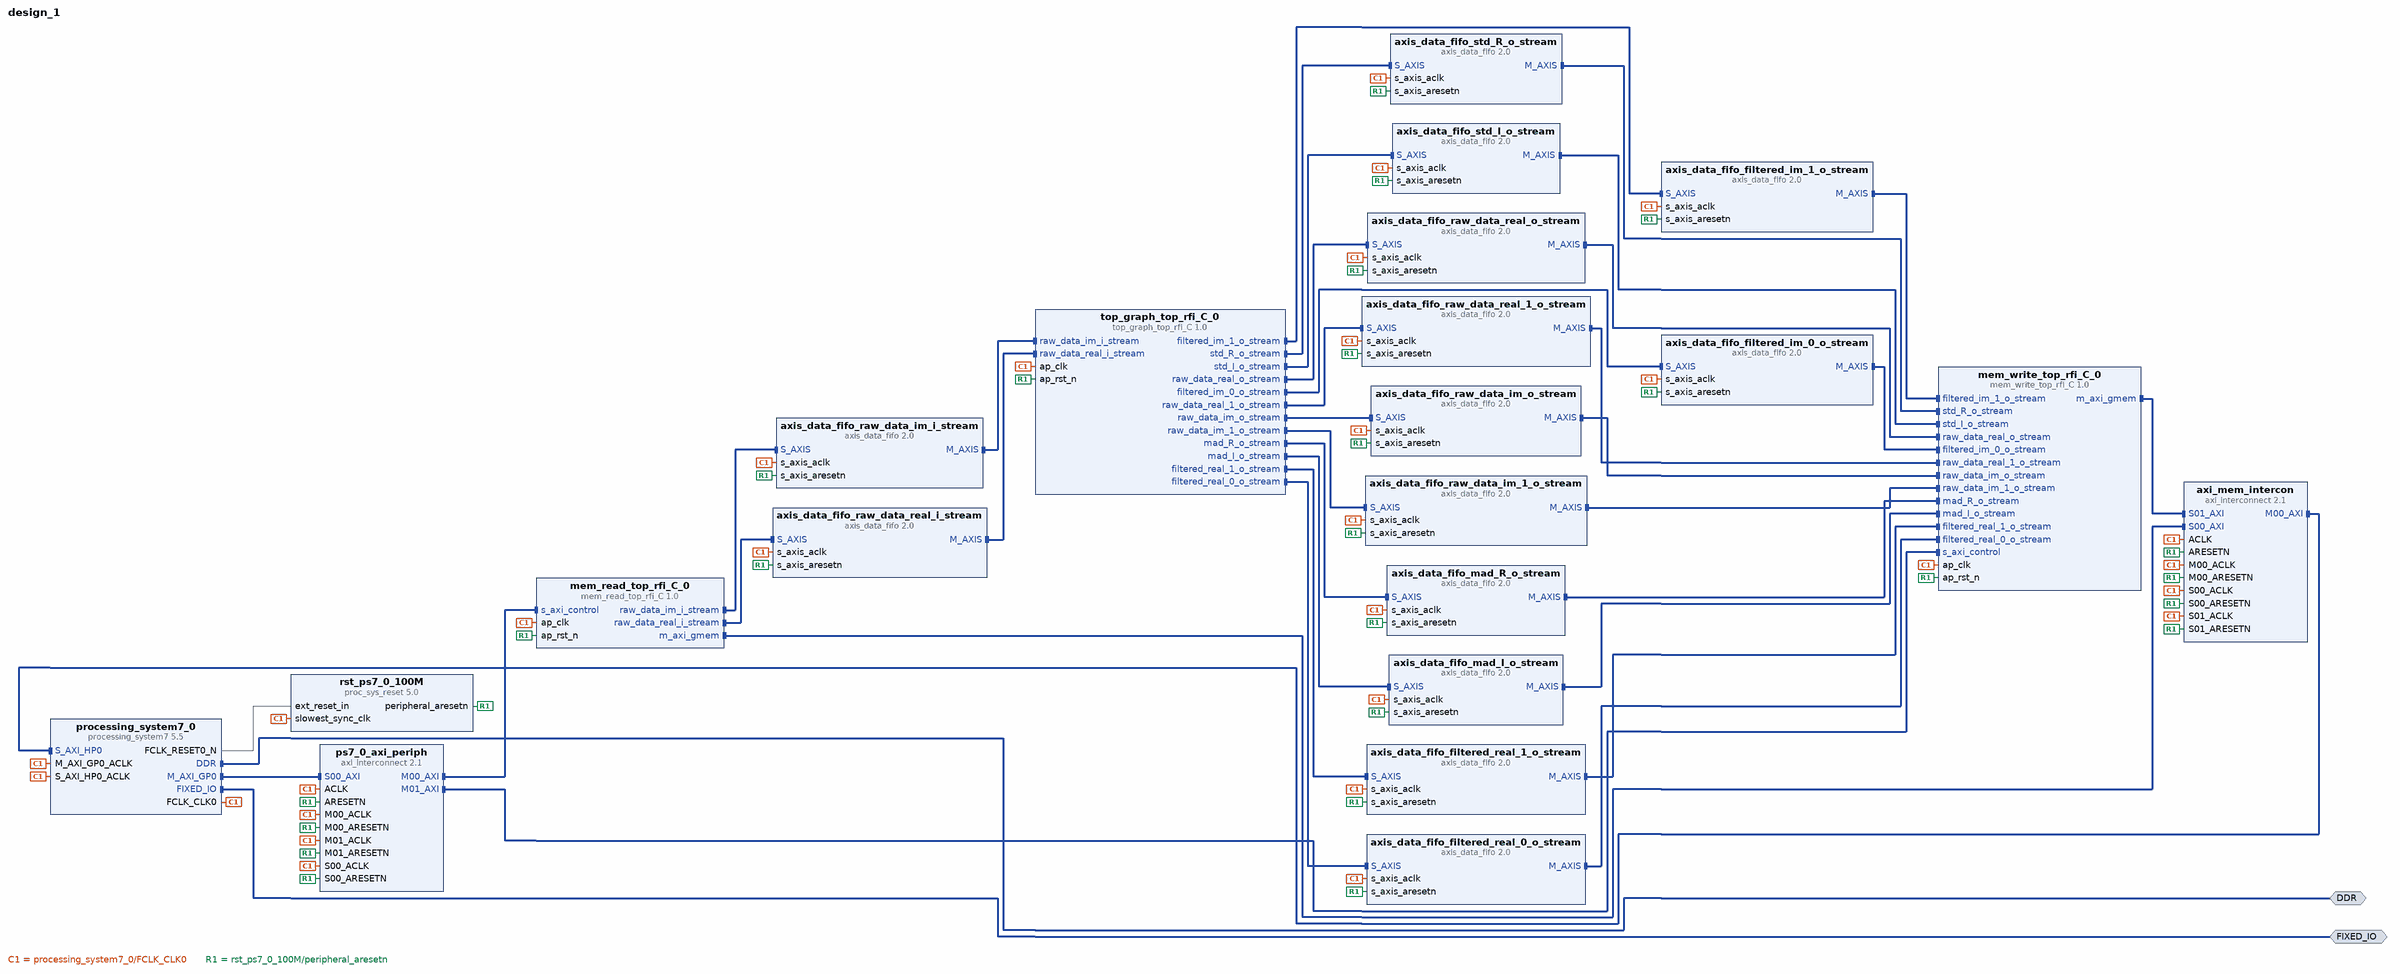
[diagram p0: block diagram of the top level]
# Vivado block design design_1, xc7z020clg400-1, Vivado 2021.2
create_bd_design design_1

create_bd_intf_port -mode Master -vlnv xilinx.com:interface:ddrx_rtl:1.0 DDR
create_bd_intf_port -mode Master -vlnv xilinx.com:display_processing_system7:fixedio_rtl:1.0 FIXED_IO

create_bd_cell -type ip -vlnv xilinx.com:ip:processing_system7:5.5 processing_system7_0
set_property -dict [list \
  CONFIG.PCW_APU_PERIPHERAL_FREQMHZ 650 \
  CONFIG.PCW_CRYSTAL_PERIPHERAL_FREQMHZ 50 \
  CONFIG.PCW_ENET0_ENET0_IO {MIO 16 .. 27} \
  CONFIG.PCW_ENET0_GRP_MDIO_ENABLE 1 \
  CONFIG.PCW_ENET0_GRP_MDIO_IO {MIO 52 .. 53} \
  CONFIG.PCW_ENET0_PERIPHERAL_ENABLE 1 \
  CONFIG.PCW_ENET0_RESET_ENABLE 1 \
  CONFIG.PCW_ENET0_RESET_IO {MIO 9} \
  CONFIG.PCW_ENET_RESET_ENABLE 1 \
  CONFIG.PCW_ENET_RESET_SELECT {Share reset pin} \
  CONFIG.PCW_FPGA0_PERIPHERAL_FREQMHZ 100 \
  CONFIG.PCW_FPGA1_PERIPHERAL_FREQMHZ 50 \
  CONFIG.PCW_GPIO_MIO_GPIO_ENABLE 1 \
  CONFIG.PCW_GPIO_MIO_GPIO_IO MIO \
  CONFIG.PCW_I2C_RESET_ENABLE 1 \
  CONFIG.PCW_M_AXI_GP0_FREQMHZ 10 \
  CONFIG.PCW_PERIPHERAL_BOARD_PRESET None \
  CONFIG.PCW_PRESET_BANK1_VOLTAGE {LVCMOS 1.8V} \
  CONFIG.PCW_QSPI_GRP_FBCLK_ENABLE 1 \
  CONFIG.PCW_QSPI_GRP_FBCLK_IO {MIO 8} \
  CONFIG.PCW_QSPI_GRP_SINGLE_SS_ENABLE 1 \
  CONFIG.PCW_QSPI_GRP_SINGLE_SS_IO {MIO 1 .. 6} \
  CONFIG.PCW_QSPI_PERIPHERAL_ENABLE 1 \
  CONFIG.PCW_QSPI_QSPI_IO {MIO 1 .. 6} \
  CONFIG.PCW_SD0_GRP_CD_ENABLE 1 \
  CONFIG.PCW_SD0_GRP_CD_IO {MIO 47} \
  CONFIG.PCW_SD0_GRP_WP_ENABLE 0 \
  CONFIG.PCW_SD0_PERIPHERAL_ENABLE 1 \
  CONFIG.PCW_SD0_SD0_IO {MIO 40 .. 45} \
  CONFIG.PCW_SDIO_PERIPHERAL_FREQMHZ 50 \
  CONFIG.PCW_SINGLE_QSPI_DATA_MODE x4 \
  CONFIG.PCW_S_AXI_HP0_FREQMHZ 10 \
  CONFIG.PCW_UART0_PERIPHERAL_ENABLE 1 \
  CONFIG.PCW_UART0_UART0_IO {MIO 14 .. 15} \
  CONFIG.PCW_UART1_PERIPHERAL_ENABLE 0 \
  CONFIG.PCW_UART_PERIPHERAL_FREQMHZ 100 \
  CONFIG.PCW_UIPARAM_DDR_BUS_WIDTH {16 Bit} \
  CONFIG.PCW_UIPARAM_DDR_FREQ_MHZ 525 \
  CONFIG.PCW_UIPARAM_DDR_PARTNO {MT41J256M16 RE-125} \
  CONFIG.PCW_USB0_PERIPHERAL_ENABLE 1 \
  CONFIG.PCW_USB0_RESET_ENABLE 1 \
  CONFIG.PCW_USB0_RESET_IO {MIO 46} \
  CONFIG.PCW_USB0_USB0_IO {MIO 28 .. 39} \
  CONFIG.PCW_USB_RESET_ENABLE 1 \
  CONFIG.PCW_USB_RESET_SELECT {Share reset pin} \
  CONFIG.PCW_USE_S_AXI_HP0 1 \
] [get_bd_cells processing_system7_0]
# 482 more settings of processing_system7_0 are not shown: defaults, MIO pin electricals, DDR timing, and values the tool derives
create_bd_cell -type ip -vlnv xilinx.com:hls:top_graph_top_rfi_C:1.0 top_graph_top_rfi_C_0
create_bd_cell -type ip -vlnv xilinx.com:hls:mem_read_top_rfi_C:1.0 mem_read_top_rfi_C_0
create_bd_cell -type ip -vlnv xilinx.com:hls:mem_write_top_rfi_C:1.0 mem_write_top_rfi_C_0
create_bd_cell -type ip -vlnv xilinx.com:ip:axi_interconnect:2.1 ps7_0_axi_periph
set_property -dict {CONFIG.NUM_MI 2} [get_bd_cells ps7_0_axi_periph]
create_bd_cell -type ip -vlnv xilinx.com:ip:proc_sys_reset:5.0 rst_ps7_0_100M
create_bd_cell -type ip -vlnv xilinx.com:ip:axi_interconnect:2.1 axi_mem_intercon
set_property -dict {CONFIG.NUM_MI 1 CONFIG.NUM_SI 2} [get_bd_cells axi_mem_intercon]
create_bd_cell -type ip -vlnv xilinx.com:ip:axis_data_fifo:2.0 axis_data_fifo_raw_data_real_i_stream
set_property -dict {CONFIG.FIFO_DEPTH 64} [get_bd_cells axis_data_fifo_raw_data_real_i_stream]
create_bd_cell -type ip -vlnv xilinx.com:ip:axis_data_fifo:2.0 axis_data_fifo_raw_data_im_i_stream
set_property -dict {CONFIG.FIFO_DEPTH 64} [get_bd_cells axis_data_fifo_raw_data_im_i_stream]
create_bd_cell -type ip -vlnv xilinx.com:ip:axis_data_fifo:2.0 axis_data_fifo_raw_data_im_o_stream
set_property -dict {CONFIG.FIFO_DEPTH 64} [get_bd_cells axis_data_fifo_raw_data_im_o_stream]
create_bd_cell -type ip -vlnv xilinx.com:ip:axis_data_fifo:2.0 axis_data_fifo_raw_data_real_o_stream
set_property -dict {CONFIG.FIFO_DEPTH 64} [get_bd_cells axis_data_fifo_raw_data_real_o_stream]
create_bd_cell -type ip -vlnv xilinx.com:ip:axis_data_fifo:2.0 axis_data_fifo_mad_R_o_stream
set_property -dict {CONFIG.FIFO_DEPTH 64} [get_bd_cells axis_data_fifo_mad_R_o_stream]
create_bd_cell -type ip -vlnv xilinx.com:ip:axis_data_fifo:2.0 axis_data_fifo_raw_data_real_1_o_stream
set_property -dict {CONFIG.FIFO_DEPTH 64} [get_bd_cells axis_data_fifo_raw_data_real_1_o_stream]
create_bd_cell -type ip -vlnv xilinx.com:ip:axis_data_fifo:2.0 axis_data_fifo_std_R_o_stream
set_property -dict {CONFIG.FIFO_DEPTH 64} [get_bd_cells axis_data_fifo_std_R_o_stream]
create_bd_cell -type ip -vlnv xilinx.com:ip:axis_data_fifo:2.0 axis_data_fifo_raw_data_im_1_o_stream
set_property -dict {CONFIG.FIFO_DEPTH 64} [get_bd_cells axis_data_fifo_raw_data_im_1_o_stream]
create_bd_cell -type ip -vlnv xilinx.com:ip:axis_data_fifo:2.0 axis_data_fifo_mad_I_o_stream
set_property -dict {CONFIG.FIFO_DEPTH 64} [get_bd_cells axis_data_fifo_mad_I_o_stream]
create_bd_cell -type ip -vlnv xilinx.com:ip:axis_data_fifo:2.0 axis_data_fifo_std_I_o_stream
set_property -dict {CONFIG.FIFO_DEPTH 64} [get_bd_cells axis_data_fifo_std_I_o_stream]
create_bd_cell -type ip -vlnv xilinx.com:ip:axis_data_fifo:2.0 axis_data_fifo_filtered_im_0_o_stream
set_property -dict {CONFIG.FIFO_DEPTH 64} [get_bd_cells axis_data_fifo_filtered_im_0_o_stream]
create_bd_cell -type ip -vlnv xilinx.com:ip:axis_data_fifo:2.0 axis_data_fifo_filtered_real_0_o_stream
set_property -dict {CONFIG.FIFO_DEPTH 64} [get_bd_cells axis_data_fifo_filtered_real_0_o_stream]
create_bd_cell -type ip -vlnv xilinx.com:ip:axis_data_fifo:2.0 axis_data_fifo_filtered_im_1_o_stream
set_property -dict {CONFIG.FIFO_DEPTH 64} [get_bd_cells axis_data_fifo_filtered_im_1_o_stream]
create_bd_cell -type ip -vlnv xilinx.com:ip:axis_data_fifo:2.0 axis_data_fifo_filtered_real_1_o_stream
set_property -dict {CONFIG.FIFO_DEPTH 64} [get_bd_cells axis_data_fifo_filtered_real_1_o_stream]

# ---- connections ----

connect_bd_intf_net [get_bd_intf_pins axi_mem_intercon/M00_AXI] [get_bd_intf_pins processing_system7_0/S_AXI_HP0]
connect_bd_intf_net [get_bd_intf_pins axis_data_fifo_filtered_im_0_o_stream/M_AXIS] [get_bd_intf_pins mem_write_top_rfi_C_0/filtered_im_0_o_stream]
connect_bd_intf_net [get_bd_intf_pins axis_data_fifo_filtered_im_1_o_stream/M_AXIS] [get_bd_intf_pins mem_write_top_rfi_C_0/filtered_im_1_o_stream]
connect_bd_intf_net [get_bd_intf_pins axis_data_fifo_filtered_real_0_o_stream/M_AXIS] [get_bd_intf_pins mem_write_top_rfi_C_0/filtered_real_0_o_stream]
connect_bd_intf_net [get_bd_intf_pins axis_data_fifo_filtered_real_1_o_stream/M_AXIS] [get_bd_intf_pins mem_write_top_rfi_C_0/filtered_real_1_o_stream]
connect_bd_intf_net [get_bd_intf_pins axis_data_fifo_mad_I_o_stream/M_AXIS] [get_bd_intf_pins mem_write_top_rfi_C_0/mad_I_o_stream]
connect_bd_intf_net [get_bd_intf_pins axis_data_fifo_mad_R_o_stream/M_AXIS] [get_bd_intf_pins mem_write_top_rfi_C_0/mad_R_o_stream]
connect_bd_intf_net [get_bd_intf_pins axis_data_fifo_raw_data_im_1_o_stream/M_AXIS] [get_bd_intf_pins mem_write_top_rfi_C_0/raw_data_im_1_o_stream]
connect_bd_intf_net [get_bd_intf_pins axis_data_fifo_raw_data_im_i_stream/M_AXIS] [get_bd_intf_pins top_graph_top_rfi_C_0/raw_data_im_i_stream]
connect_bd_intf_net [get_bd_intf_pins axis_data_fifo_raw_data_im_o_stream/M_AXIS] [get_bd_intf_pins mem_write_top_rfi_C_0/raw_data_im_o_stream]
connect_bd_intf_net [get_bd_intf_pins axis_data_fifo_raw_data_real_1_o_stream/M_AXIS] [get_bd_intf_pins mem_write_top_rfi_C_0/raw_data_real_1_o_stream]
connect_bd_intf_net [get_bd_intf_pins axis_data_fifo_raw_data_real_i_stream/M_AXIS] [get_bd_intf_pins top_graph_top_rfi_C_0/raw_data_real_i_stream]
connect_bd_intf_net [get_bd_intf_pins axis_data_fifo_raw_data_real_o_stream/M_AXIS] [get_bd_intf_pins mem_write_top_rfi_C_0/raw_data_real_o_stream]
connect_bd_intf_net [get_bd_intf_pins axis_data_fifo_std_I_o_stream/M_AXIS] [get_bd_intf_pins mem_write_top_rfi_C_0/std_I_o_stream]
connect_bd_intf_net [get_bd_intf_pins axis_data_fifo_std_R_o_stream/M_AXIS] [get_bd_intf_pins mem_write_top_rfi_C_0/std_R_o_stream]
connect_bd_intf_net [get_bd_intf_pins mem_read_top_rfi_C_0/m_axi_gmem] [get_bd_intf_pins axi_mem_intercon/S00_AXI]
connect_bd_intf_net [get_bd_intf_pins mem_read_top_rfi_C_0/raw_data_im_i_stream] [get_bd_intf_pins axis_data_fifo_raw_data_im_i_stream/S_AXIS]
connect_bd_intf_net [get_bd_intf_pins mem_read_top_rfi_C_0/raw_data_real_i_stream] [get_bd_intf_pins axis_data_fifo_raw_data_real_i_stream/S_AXIS]
connect_bd_intf_net [get_bd_intf_pins mem_write_top_rfi_C_0/m_axi_gmem] [get_bd_intf_pins axi_mem_intercon/S01_AXI]
connect_bd_intf_net [get_bd_intf_ports DDR] [get_bd_intf_pins processing_system7_0/DDR]
connect_bd_intf_net [get_bd_intf_ports FIXED_IO] [get_bd_intf_pins processing_system7_0/FIXED_IO]
connect_bd_intf_net [get_bd_intf_pins processing_system7_0/M_AXI_GP0] [get_bd_intf_pins ps7_0_axi_periph/S00_AXI]
connect_bd_intf_net [get_bd_intf_pins ps7_0_axi_periph/M00_AXI] [get_bd_intf_pins mem_read_top_rfi_C_0/s_axi_control]
connect_bd_intf_net [get_bd_intf_pins ps7_0_axi_periph/M01_AXI] [get_bd_intf_pins mem_write_top_rfi_C_0/s_axi_control]
connect_bd_intf_net [get_bd_intf_pins top_graph_top_rfi_C_0/filtered_im_0_o_stream] [get_bd_intf_pins axis_data_fifo_filtered_im_0_o_stream/S_AXIS]
connect_bd_intf_net [get_bd_intf_pins top_graph_top_rfi_C_0/filtered_im_1_o_stream] [get_bd_intf_pins axis_data_fifo_filtered_im_1_o_stream/S_AXIS]
connect_bd_intf_net [get_bd_intf_pins top_graph_top_rfi_C_0/filtered_real_0_o_stream] [get_bd_intf_pins axis_data_fifo_filtered_real_0_o_stream/S_AXIS]
connect_bd_intf_net [get_bd_intf_pins top_graph_top_rfi_C_0/filtered_real_1_o_stream] [get_bd_intf_pins axis_data_fifo_filtered_real_1_o_stream/S_AXIS]
connect_bd_intf_net [get_bd_intf_pins top_graph_top_rfi_C_0/mad_I_o_stream] [get_bd_intf_pins axis_data_fifo_mad_I_o_stream/S_AXIS]
connect_bd_intf_net [get_bd_intf_pins top_graph_top_rfi_C_0/mad_R_o_stream] [get_bd_intf_pins axis_data_fifo_mad_R_o_stream/S_AXIS]
connect_bd_intf_net [get_bd_intf_pins top_graph_top_rfi_C_0/raw_data_im_1_o_stream] [get_bd_intf_pins axis_data_fifo_raw_data_im_1_o_stream/S_AXIS]
connect_bd_intf_net [get_bd_intf_pins top_graph_top_rfi_C_0/raw_data_im_o_stream] [get_bd_intf_pins axis_data_fifo_raw_data_im_o_stream/S_AXIS]
connect_bd_intf_net [get_bd_intf_pins top_graph_top_rfi_C_0/raw_data_real_1_o_stream] [get_bd_intf_pins axis_data_fifo_raw_data_real_1_o_stream/S_AXIS]
connect_bd_intf_net [get_bd_intf_pins top_graph_top_rfi_C_0/raw_data_real_o_stream] [get_bd_intf_pins axis_data_fifo_raw_data_real_o_stream/S_AXIS]
connect_bd_intf_net [get_bd_intf_pins top_graph_top_rfi_C_0/std_I_o_stream] [get_bd_intf_pins axis_data_fifo_std_I_o_stream/S_AXIS]
connect_bd_intf_net [get_bd_intf_pins top_graph_top_rfi_C_0/std_R_o_stream] [get_bd_intf_pins axis_data_fifo_std_R_o_stream/S_AXIS]
connect_bd_net [get_bd_pins processing_system7_0/FCLK_CLK0] \
  [get_bd_pins processing_system7_0/M_AXI_GP0_ACLK] [get_bd_pins ps7_0_axi_periph/S00_ACLK] \
  [get_bd_pins rst_ps7_0_100M/slowest_sync_clk] [get_bd_pins mem_read_top_rfi_C_0/ap_clk] \
  [get_bd_pins ps7_0_axi_periph/M00_ACLK] [get_bd_pins ps7_0_axi_periph/ACLK] [get_bd_pins mem_write_top_rfi_C_0/ap_clk] \
  [get_bd_pins ps7_0_axi_periph/M01_ACLK] [get_bd_pins axi_mem_intercon/S00_ACLK] \
  [get_bd_pins processing_system7_0/S_AXI_HP0_ACLK] [get_bd_pins axi_mem_intercon/M00_ACLK] \
  [get_bd_pins axi_mem_intercon/ACLK] [get_bd_pins axi_mem_intercon/S01_ACLK] [get_bd_pins top_graph_top_rfi_C_0/ap_clk] \
  [get_bd_pins axis_data_fifo_raw_data_real_i_stream/s_axis_aclk] \
  [get_bd_pins axis_data_fifo_raw_data_im_i_stream/s_axis_aclk] [get_bd_pins axis_data_fifo_raw_data_im_o_stream/s_axis_aclk] \
  [get_bd_pins axis_data_fifo_raw_data_real_o_stream/s_axis_aclk] [get_bd_pins axis_data_fifo_mad_R_o_stream/s_axis_aclk] \
  [get_bd_pins axis_data_fifo_raw_data_real_1_o_stream/s_axis_aclk] [get_bd_pins axis_data_fifo_std_R_o_stream/s_axis_aclk] \
  [get_bd_pins axis_data_fifo_raw_data_im_1_o_stream/s_axis_aclk] [get_bd_pins axis_data_fifo_mad_I_o_stream/s_axis_aclk] \
  [get_bd_pins axis_data_fifo_std_I_o_stream/s_axis_aclk] [get_bd_pins axis_data_fifo_filtered_im_0_o_stream/s_axis_aclk] \
  [get_bd_pins axis_data_fifo_filtered_real_0_o_stream/s_axis_aclk] \
  [get_bd_pins axis_data_fifo_filtered_im_1_o_stream/s_axis_aclk] \
  [get_bd_pins axis_data_fifo_filtered_real_1_o_stream/s_axis_aclk]
connect_bd_net [get_bd_pins processing_system7_0/FCLK_RESET0_N] [get_bd_pins rst_ps7_0_100M/ext_reset_in]
connect_bd_net [get_bd_pins rst_ps7_0_100M/peripheral_aresetn] \
  [get_bd_pins ps7_0_axi_periph/S00_ARESETN] [get_bd_pins mem_read_top_rfi_C_0/ap_rst_n] \
  [get_bd_pins ps7_0_axi_periph/M00_ARESETN] [get_bd_pins ps7_0_axi_periph/ARESETN] \
  [get_bd_pins mem_write_top_rfi_C_0/ap_rst_n] [get_bd_pins ps7_0_axi_periph/M01_ARESETN] \
  [get_bd_pins axi_mem_intercon/S00_ARESETN] [get_bd_pins axi_mem_intercon/M00_ARESETN] \
  [get_bd_pins axi_mem_intercon/ARESETN] [get_bd_pins axi_mem_intercon/S01_ARESETN] \
  [get_bd_pins top_graph_top_rfi_C_0/ap_rst_n] [get_bd_pins axis_data_fifo_raw_data_real_i_stream/s_axis_aresetn] \
  [get_bd_pins axis_data_fifo_raw_data_im_i_stream/s_axis_aresetn] \
  [get_bd_pins axis_data_fifo_raw_data_im_o_stream/s_axis_aresetn] \
  [get_bd_pins axis_data_fifo_raw_data_real_o_stream/s_axis_aresetn] \
  [get_bd_pins axis_data_fifo_mad_R_o_stream/s_axis_aresetn] \
  [get_bd_pins axis_data_fifo_raw_data_real_1_o_stream/s_axis_aresetn] \
  [get_bd_pins axis_data_fifo_std_R_o_stream/s_axis_aresetn] \
  [get_bd_pins axis_data_fifo_raw_data_im_1_o_stream/s_axis_aresetn] \
  [get_bd_pins axis_data_fifo_mad_I_o_stream/s_axis_aresetn] [get_bd_pins axis_data_fifo_std_I_o_stream/s_axis_aresetn] \
  [get_bd_pins axis_data_fifo_filtered_im_0_o_stream/s_axis_aresetn] \
  [get_bd_pins axis_data_fifo_filtered_real_0_o_stream/s_axis_aresetn] \
  [get_bd_pins axis_data_fifo_filtered_im_1_o_stream/s_axis_aresetn] \
  [get_bd_pins axis_data_fifo_filtered_real_1_o_stream/s_axis_aresetn]

# ---- address map ----
assign_bd_address -offset 0x0000000000000000 -range 512M -target_address_space [get_bd_addr_spaces mem_read_top_rfi_C_0/Data_m_axi_gmem] [get_bd_addr_segs processing_system7_0/S_AXI_HP0/HP0_DDR_LOWOCM]
assign_bd_address -offset 0x0000000000000000 -range 512M -target_address_space [get_bd_addr_spaces mem_write_top_rfi_C_0/Data_m_axi_gmem] [get_bd_addr_segs processing_system7_0/S_AXI_HP0/HP0_DDR_LOWOCM]
assign_bd_address -offset 0x40000000 -range 64K -target_address_space [get_bd_addr_spaces processing_system7_0/Data] [get_bd_addr_segs mem_read_top_rfi_C_0/s_axi_control/Reg]
assign_bd_address -offset 0x40010000 -range 64K -target_address_space [get_bd_addr_spaces processing_system7_0/Data] [get_bd_addr_segs mem_write_top_rfi_C_0/s_axi_control/Reg]

validate_bd_design
save_bd_design
